# EAGLE schematic dac (EAGLE 8.7.1)

## Sheet 1 of 2
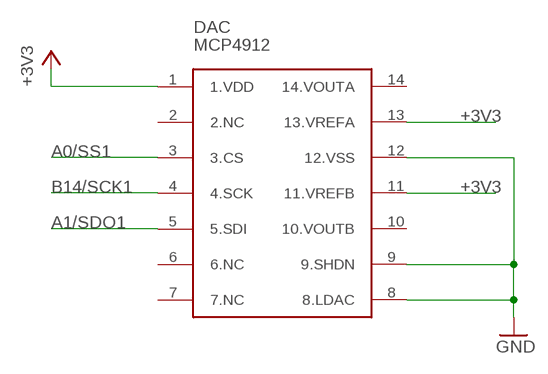
[diagram p0: schematic, sheet 1]

### Parts
DAC  MCP4912  [MCP4912]

### Nets
+3V3: DAC.1(1.VDD) DAC.11(11.VREFB) DAC.13(13.VREFA) ; also sheet 2
A0/SS1: DAC.3(3.CS)
A1/SDO1: DAC.5(5.SDI)
B14/SCK1: DAC.4(4.SCK)
GND: DAC.8(8.LDAC) DAC.9(9.SHDN) DAC.12(12.VSS) ; also sheet 2
Unconnected: DAC.2(2.NC) DAC.6(6.NC) DAC.7(7.NC) DAC.10(10.VOUTB) DAC.14(14.VOUTA)

## Sheet 2 of 2
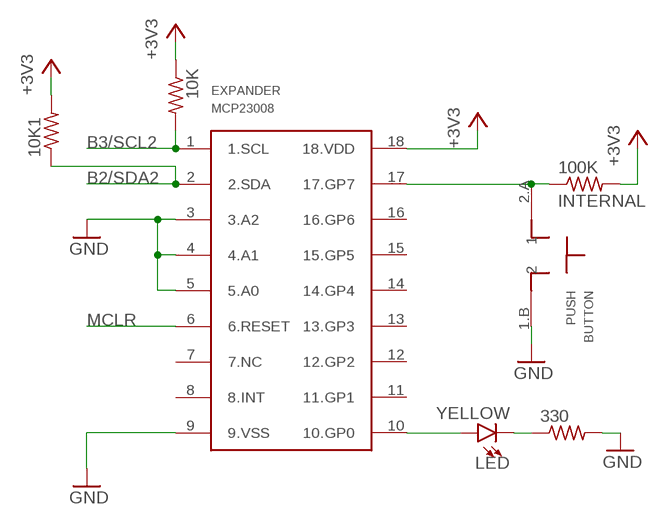
[diagram p1: schematic, sheet 2]

### Parts
10K  R-US_R0603  [R0603]
10K1  R-US_R0603  [R0603]
100K  INTERNAL  R-US_R0603  [R0603]
330  R-US_R0603  [R0603]
BUTTON  PUSH  [NU32V7_MOM_SW]
EXPANDER  MCP23008  [MCP23008]
LED  YELLOW  LED-RED0603  [LED-0603]

### Nets
+3V3: 10K1.2 10K.1 100K.2 EXPANDER.18(18.VDD) ; also sheet 1
B2/SDA2: 10K1.1 EXPANDER.2(2.SDA)
B3/SCL2: 10K.2 EXPANDER.1(1.SCL)
GND: 330.2 BUTTON.1.B EXPANDER.3(3.A2) EXPANDER.4(4.A1) EXPANDER.5(5.A0) EXPANDER.9(9.VSS) ; also sheet 1
MCLR: EXPANDER.6(6.RESET)
N$1: EXPANDER.10(10.GP0) LED.A
N$2: 100K.1 BUTTON.2.A EXPANDER.17(17.GP7)
N$6: 330.1 LED.C
Unconnected: EXPANDER.7(7.NC) EXPANDER.8(8.INT) EXPANDER.11(11.GP1) EXPANDER.12(12.GP2) EXPANDER.13(13.GP3) EXPANDER.14(14.GP4) EXPANDER.15(15.GP5) EXPANDER.16(16.GP6)

## Library data of the parts
10K 10K1 100K 330 = me433:R-US_: RESISTOR, American symbol
BUTTON = me433:PUSH
DAC = me433:MCP4912
EXPANDER = me433:MCP23008
LED = me433:LED-RED: Red SMD LED Used in manufacturing of most products at SparkFun Packages: 0603 - SMD 0603 package [Product Link] <http://docs.avagotech.com/docs/AV02-0551EN> 0603 SMART - SMD 0603 SMART package ( more efficient and expensive)[Product Link] <http://www.osram-os.com/Graphics/XPic2/00077099_0.pdf> 1206 - SMD1206 package [Product Link] <https://www.sparkfun.com/datasheets/DevTools/LilyPad/Q150OVS4.pdff> SparkFun Products: Pro Mini 328 -5V <https://www.sparkfun.com/products/821> RedBoard <https://www.sparkfun.com/products/12757> IOIO-OTG <https://www.sparkfun.com/products/13613>; PROD_ID: DIO-00819; VALUE: RED